# EAGLE design 00A-051 (EAGLE 6.3)
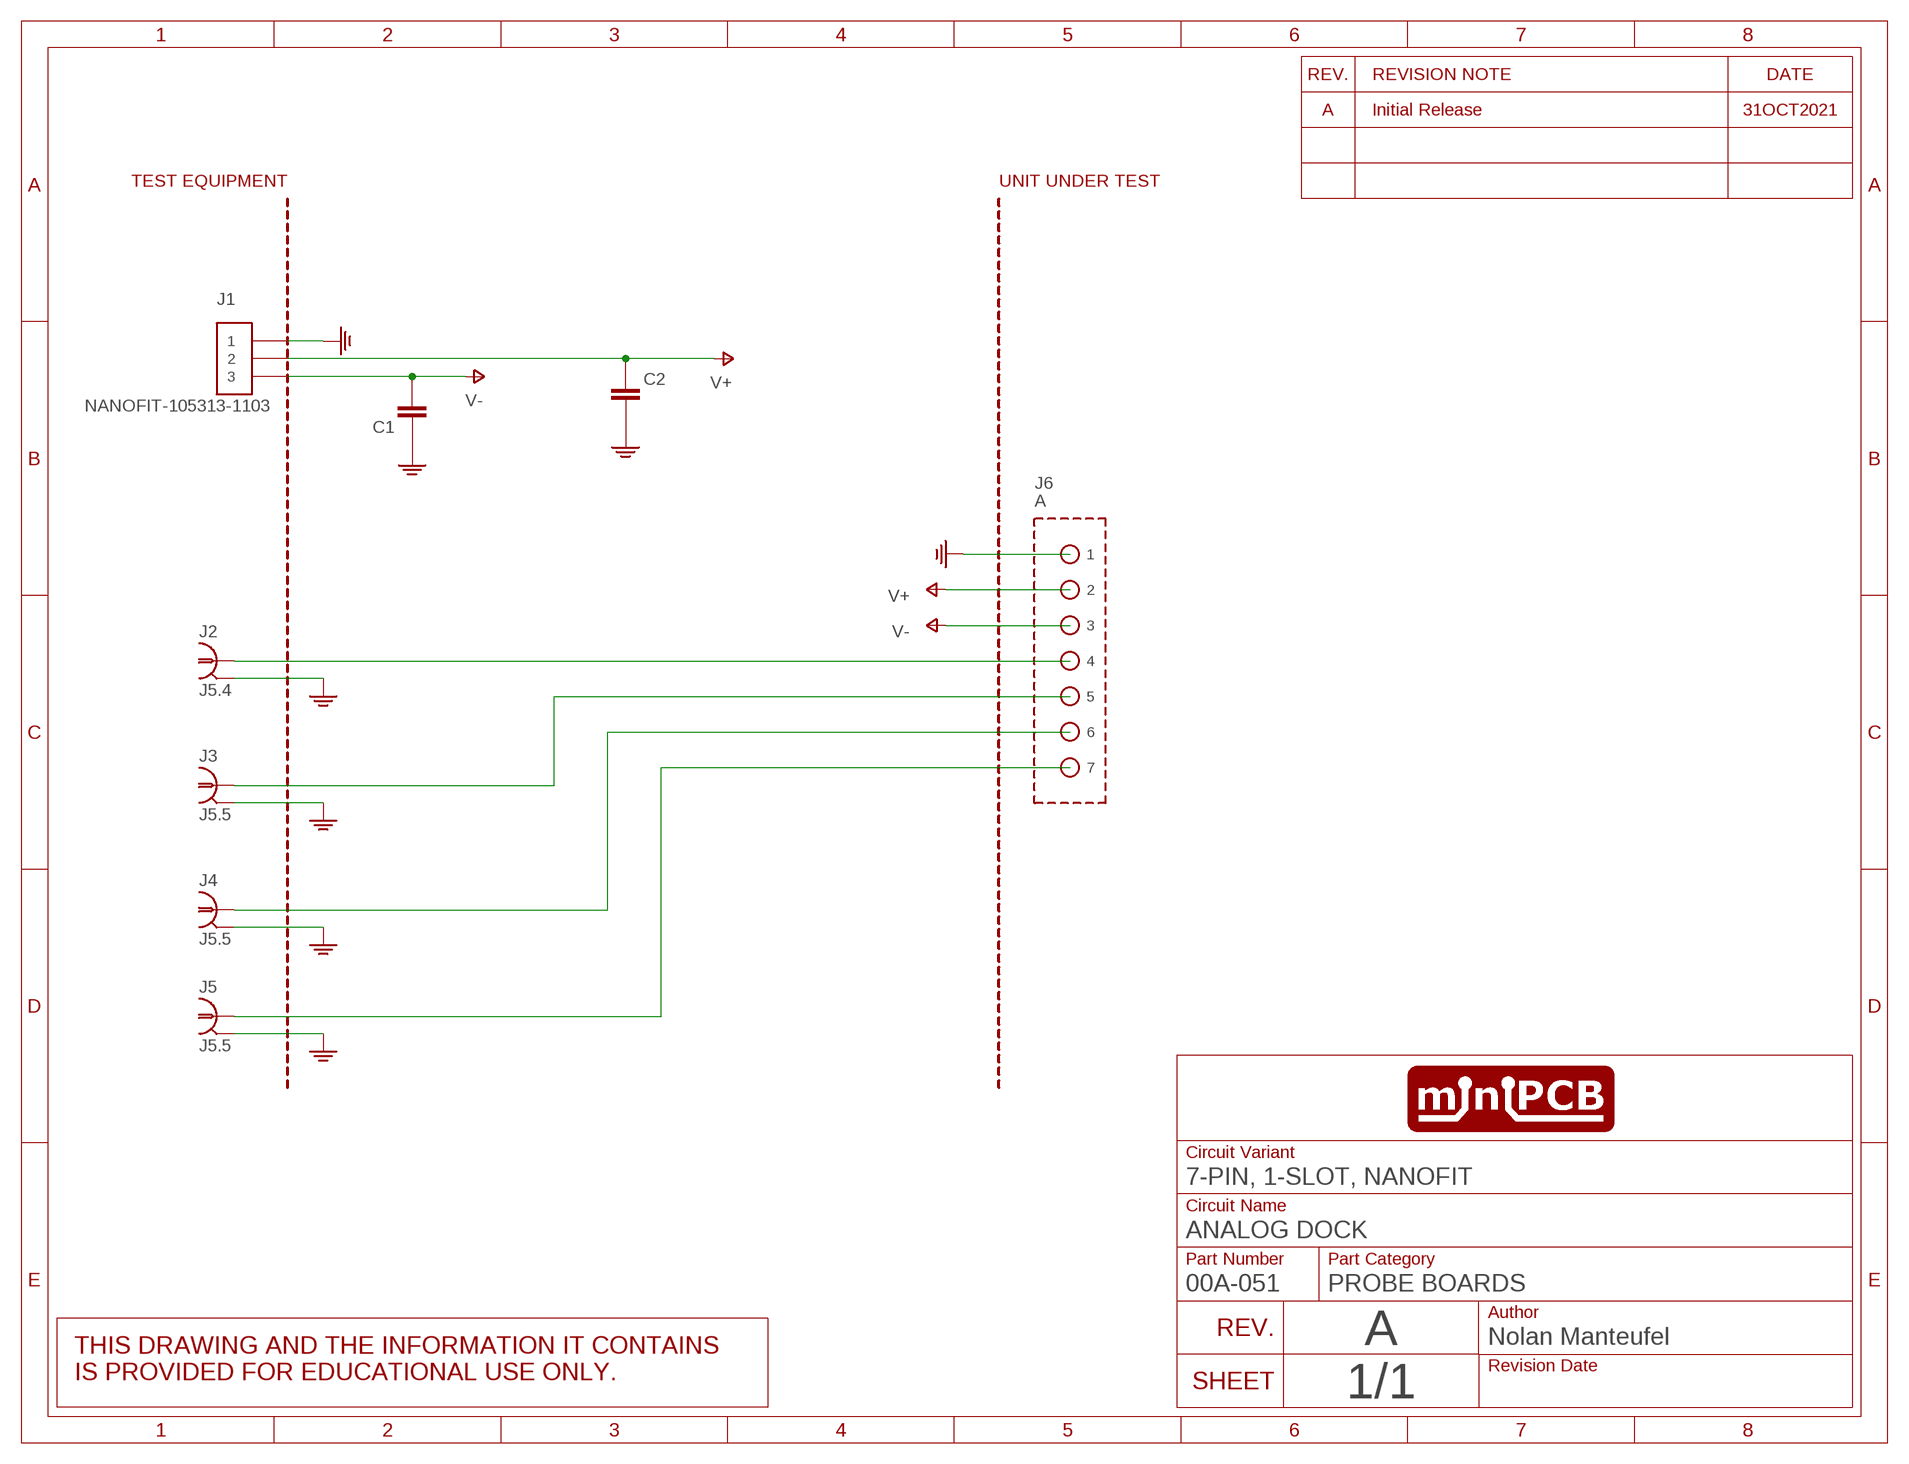
[diagram p0: schematic, sheet 1]
SHEET1 (SCHEMATIC): CIRCUIT_CATEGORY: PROBE BOARDS; CIRCUIT_NAME: ANALOG DOCK; REVISION: A

## Parts
C1  CAPACITOR_10  [C5MM]
C2  CAPACITOR_10  [C5MM]
J1  NANOFIT-105313-1103  PINS_3-NANOFIT-105313-1103  [PINS_3-NANOFIT-H]
J2  J5.4  BNC_35N14  [B35N14H]
J3  J5.5  BNC_35N14  [B35N14H]
J4  J5.5  BNC_35N14  [B35N14H]
J5  J5.5  BNC_35N14  [B35N14H]
J6  A  MINIPCB_DOCK_7P  [MINIPCB_DOCK_7P]
PCB  MINIPCB_0PDOCK_50X100  [MINIPCB_DOCK_50X100]

## Nets
CH1: J2.1.SIG J6.4
CH2: J3.1.SIG J6.5
CH3: J4.1.SIG J6.6
CH4: J5.1.SIG J6.7
GND: C1.+ C2.- J1.1 J2.2.GND(GND) J2.3.GND(GND) J2.4.GND(GND) J2.5.GND(GND) J3.2.GND(GND) J3.3.GND(GND) J3.4.GND(GND) J3.5.GND(GND) J4.2.GND(GND) J4.3.GND(GND) J4.4.GND(GND) J4.5.GND(GND) J5.2.GND(GND) J5.3.GND(GND) J5.4.GND(GND) J5.5.GND(GND) J6.1
V+: C2.+ J1.2 J6.2
V-: C1.- J1.3 J6.3

## Notes on the sheet
- 31OCT2021

## Library data of the parts
C1 C2 = minipcb:CAPACITOR
J1 = minipcb:PINS_3
J2-J5 = minipcb:BNC
J6 = minipcb:MINIPCB_DOCK_7P; SLOT: A
PCB = minipcb:MINIPCB_0P; PART_NUMBER: 00A-051; REVISION: A

## Board
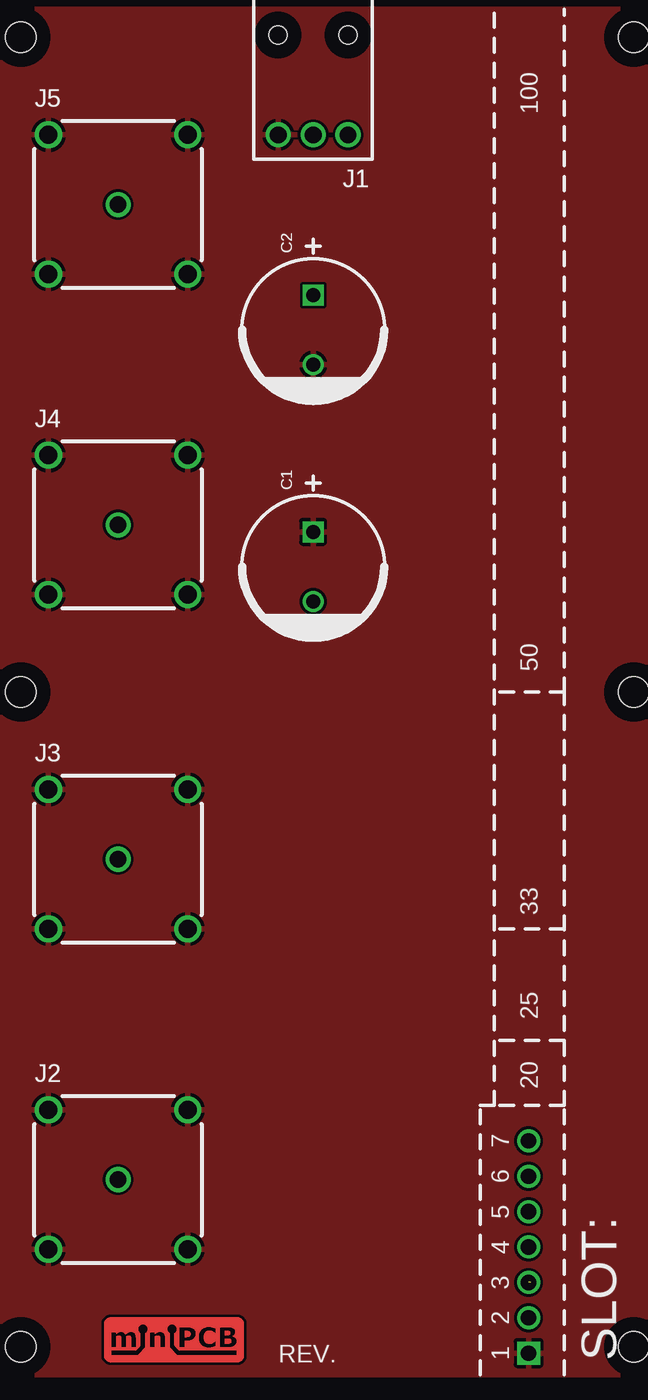
[diagram p1: board, top side]
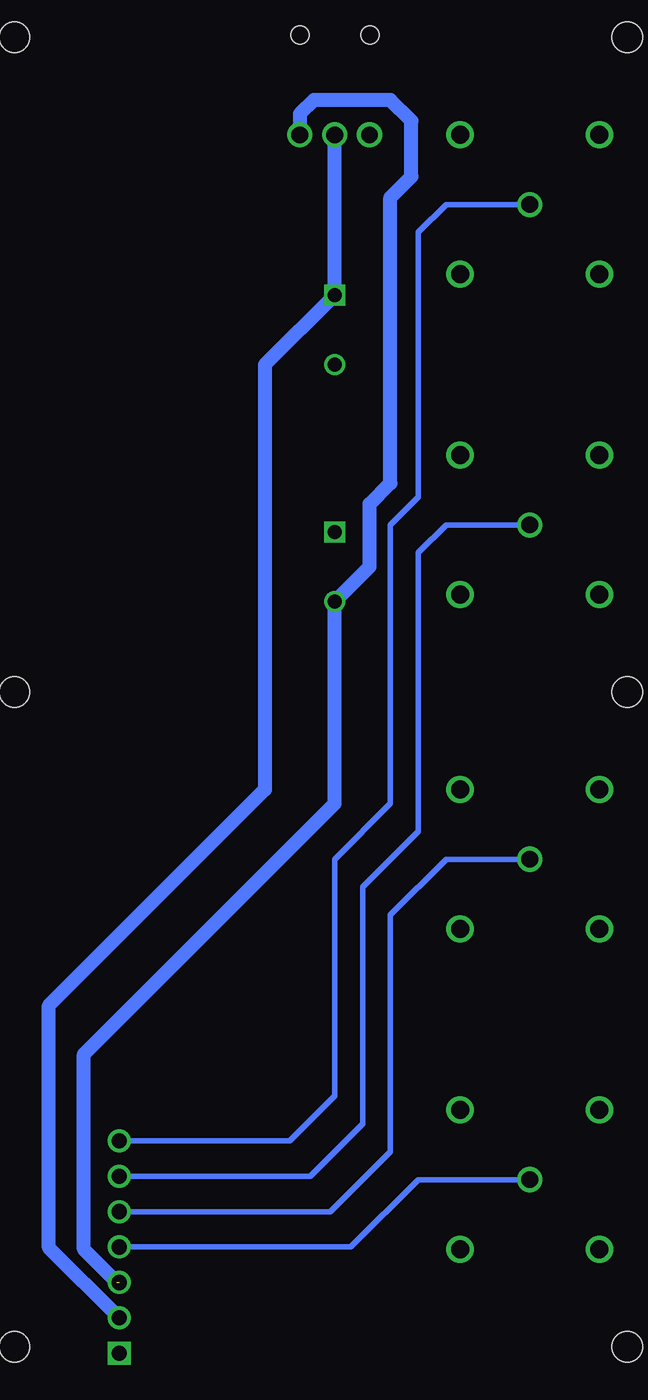
[diagram p2: board, bottom side, seen from below]

No outline drawn. Coordinates in mm, seen from the top.
Copper layers (1*16): Top 0.035mm / dielectric 1.5mm / Bottom 0.035mm
Design rules "default": minimum track width 10mil, minimum drill 24mil, track to track 8mil, track to pad 8mil, pad to pad 8mil, via to via 8mil, smd to smd 8mil, copper to edge 40mil, drill to drill 8mil, minimum pad ring 10mil, minimum via ring 8mil, stop-mask expansion 4mil, vias tented up to drill 0mil, thermal gap 10mil
bRestrict: 1 lines

### Footprints (pad centres in the part's own frame; a part is rotated, then mirrored left to right if it is on the bottom)
C5MM = drill 1 square: + -2.5,0 | drill 1: - 2.5,0
PINS_3-NANOFIT-H = drill 1.2: 1 -2.5,0; 2 0,0; 3 2.5,0 | hole 1.3: -2.52,7.18; 2.5,7.18
B35N14H = drill 1.2: 1.SIG 0,0 | drill 1.3: 2.GND 5,5; 3.GND 5,-5; 4.GND -5,-5; 5.GND -5,5
MINIPCB_DOCK_7P = drill 1.1 square: 1 2.54,2.54 | drill 1.1: 2 5.08,2.54; 3 7.62,2.54; 4 10.16,2.54; 5 12.7,2.54; 6 15.24,2.54; 7 17.78,2.54
MINIPCB_DOCK_50X100 = hole 2.2: 3,97; 3,50; 3,3; 47,3; 47,50; 47,97

### Placement (x,y rotation side)
C1  24,59 270 top
C2  24,76 270 top
J1  24,90 0 top
J2  10,15 0 top
J3  10,38 0 top
J4  10,62 0 top
J5  10,85 0 top
J6  42,0 90 top
PCB  0,0 0 top

### Tracks (layer width: path | path; a pad name or v marks a point on that pad's centre or on a via)
CH1
  Bottom 0.406: J2.1.SIG 18,15 22.84,10.16 J6.4
CH2
  Bottom 0.406: J3.1.SIG 16,38 20,34 20,17 24.3,12.7 J6.5
CH3
  Bottom 0.406: J4.1.SIG 16,62 18,60 18,40 22,36 22,19 25.76,15.24 J6.6
CH4
  Bottom 0.406: J5.1.SIG 16,85 18,83 18,64 20,62 20,42 24,38 24,21 27.22,17.78 J6.7
GND
  pour Top: 1,1 49,1 49,99 1,99
V+
  Bottom 1.016: J1.2 C2.+ 29,73.5 29,43 44.5,27.5 44.5,10.12 J6.2
V-  (1 unrouted)
  Bottom 1.016: J1.3 26.5,91.5 25.5,92.5 20,92.5 18.5,91 18.5,87 20,85.5 20,65 21.5,63.5 21.5,59 C1.- 24,42 42,24 42,10 39.62,7.62

### Text on the board
_tNames: J5 | J1 | C2 | J4 | C1 | J3 | J2